# EAGLE design HighPowerWS2801_v1_smd (EAGLE 8.0.0)
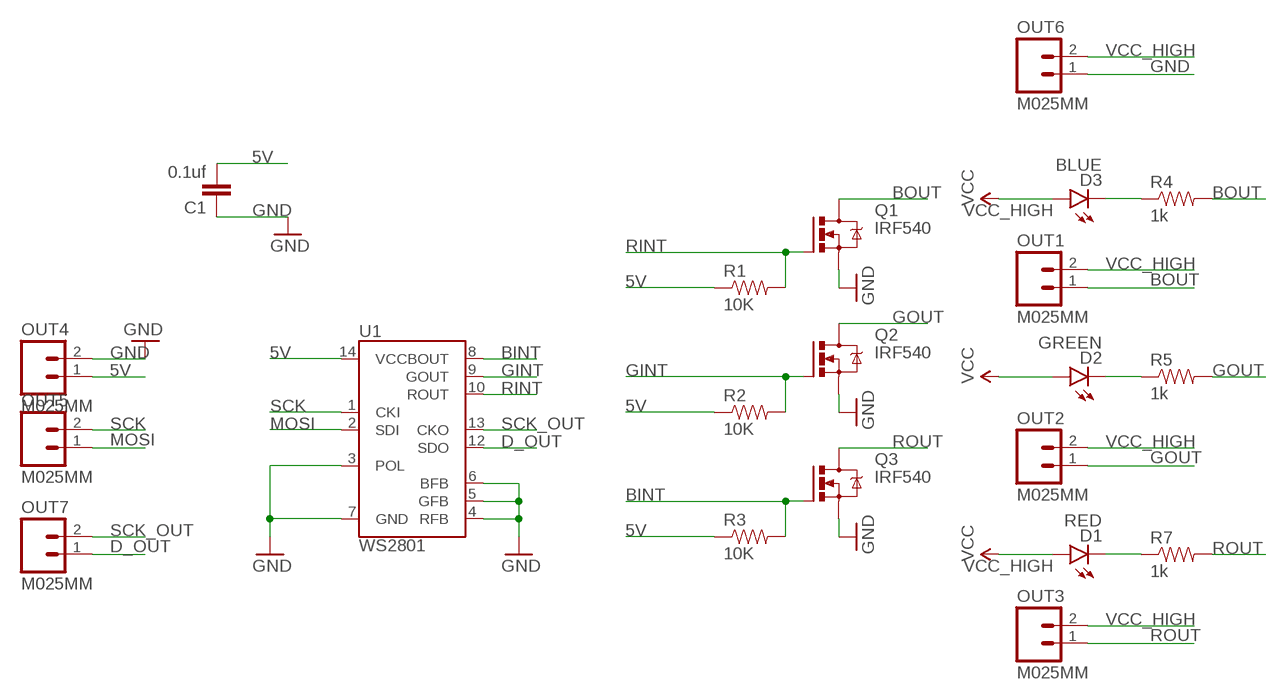
[diagram p0: schematic, sheet 1]

## Parts
C1  0.1uf  CAP0603-CAP  [0603-CAP]
D1  RED  LED-RED0603  [LED-0603]
D2  GREEN  LED-GREEN0603  [LED-0603]
D3  BLUE  LED-BLUE0603  [LED-0603]
OUT1  M025MM  [SCREWTERMINAL-5MM-2]
OUT2  M025MM  [SCREWTERMINAL-5MM-2]
OUT3  M025MM  [SCREWTERMINAL-5MM-2]
OUT4  M025MM  [SCREWTERMINAL-5MM-2]
OUT5  M025MM  [SCREWTERMINAL-5MM-2]
OUT6  M025MM  [SCREWTERMINAL-5MM-2]
OUT7  M025MM  [SCREWTERMINAL-5MM-2]
Q1  IRF540  [TO220BV]
Q2  IRF540  [TO220BV]
Q3  IRF540  [TO220BV]
R1  10K  RESISTOR0603  [0603-RES]
R2  10K  RESISTOR0603  [0603-RES]
R3  10K  RESISTOR0603  [0603-RES]
R4  1k  RESISTOR0603  [0603-RES]
R5  1k  RESISTOR0603  [0603-RES]
R7  1k  RESISTOR0603  [0603-RES]
U1  WS2801  [SOP-14]

## Nets
5V: C1.2 OUT4.1 R1.1 R2.1 R3.1 U1.14(VCC)
BINT: Q3.G R3.2 U1.8(BOUT)
BOUT: OUT1.1 Q1.D R4.2
D_OUT: OUT7.1 U1.12(SDO)
GINT: Q2.G R2.2 U1.9(GOUT)
GND: C1.1 OUT4.2 OUT6.1 Q1.S Q2.S Q3.S U1.3(POL) U1.4(RFB) U1.5(GFB) U1.6(BFB) U1.7(GND)
GOUT: OUT2.1 Q2.D R5.2
MOSI: OUT5.1 U1.2(SDI)
N$1: D3.C R4.1
N$2: D2.C R5.1
N$6: D1.C R7.1
RINT: Q1.G R1.2 U1.10(ROUT)
ROUT: OUT3.1 Q3.D R7.2
SCK: OUT5.2 U1.1(CKI)
SCK_OUT: OUT7.2 U1.13(CKO)
VCC_HIGH: D1.A D2.A D3.A OUT1.2 OUT2.2 OUT3.2 OUT6.2 ; supply symbol labelled VCC

## Library data of the parts
C1 = SparkFun-Capacitors:CAP: Capacitor Standard 0603 ceramic capacitor, and 0.1" leaded capacitor.
D1 = SparkFun-LED:LED-RED: Assorted Red LEDs LilyPad 1206- DIO-09912 1206- DIO-00809 0603- DIO-00819 "SMART" means more efficient and expensive; PROD_ID: DIO-00819
D2 = SparkFun-LED:LED-GREEN: Various green LEDs Green LEDs used in SFE Production 0603- DIO-00821 LARGE- DIO-00862 LILYPAD- DIO-09910; PROD_ID: DIO-00821
D3 = SparkFun-LED:LED-BLUE: Blue LEDs for production use Various blue LEDs stocked by SparkFun production 0603 - DIO-08575 Rebel - DIO-09553 1206 - DIO-09911; PROD_ID: DIO-08575
OUT1-OUT7 = SparkFun-Connectors:M02: Standard 2-pin 0.1" header. Use with - straight break away headers ( PRT-00116) - right angle break away headers (PRT-00553) - swiss pins (PRT-00743) - machine pins (PRT-00117) - female headers (PRT-00115) Molex polarized connector foot print use with: PRT-08233 with associated crimp pins and housings. 2.54_SCREWTERM for use with PRT-10571. 3.5mm Screw Terminal footprints for PRT-08084 5mm Screw Terminal footprints for use with PRT-08433
Q1-Q3 = transistor-power:IRF540: HEXFET Power MOSFET
R1-R5 R7 = SparkFun-Resistors:RESISTOR: Resistor Basic schematic elements and footprints for 0603, 1206, and PTH resistors.
U1 = SparkFun-DigitalIC:WS2801: WS2801 3 Channel Constant Current LED Driver with programmable PWM outputs. Datasheet: http://www.sparkfun.com/datasheets/Components/LED/WS2801.pdf

## Board
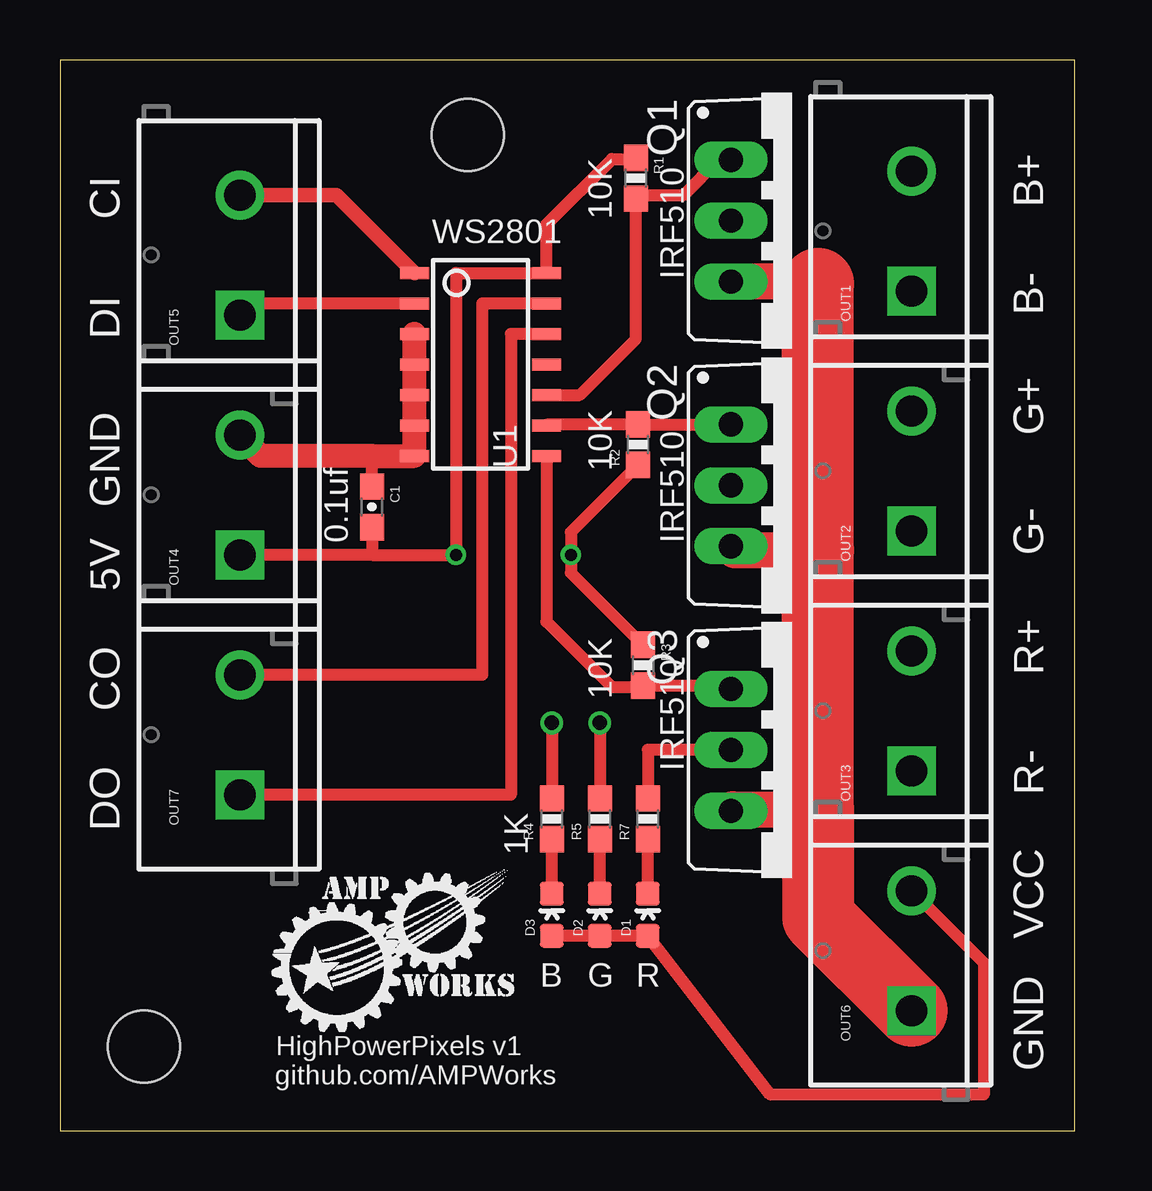
[diagram p1: board, top side]
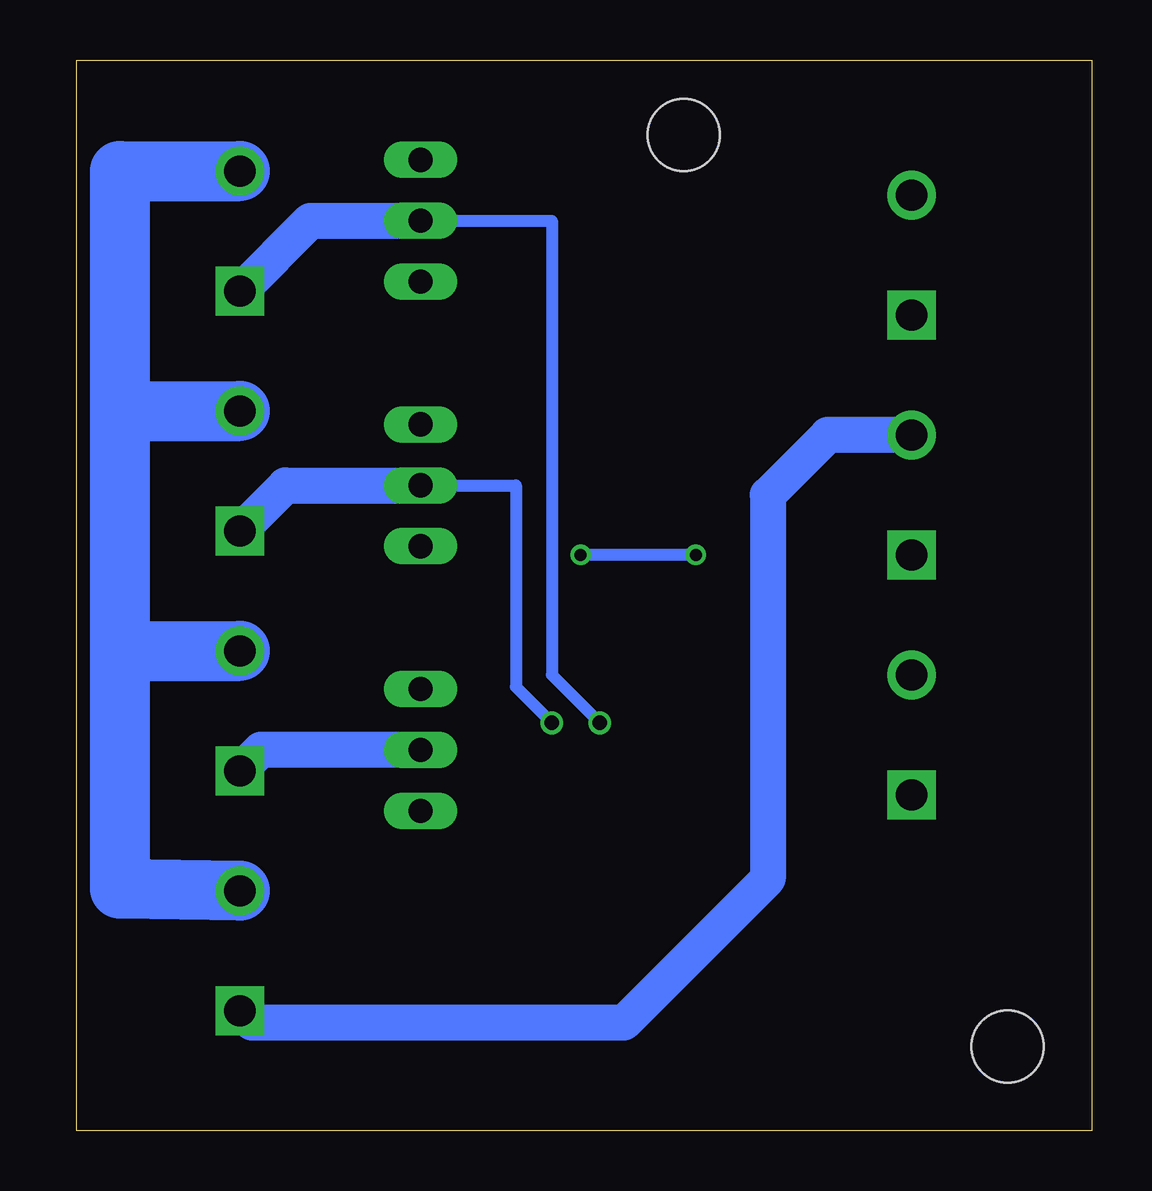
[diagram p2: board, bottom side, seen from below]

Size 42.3 x 44.63 mm. Coordinates in mm from the lower left corner, seen from the top.
Outline: 0,0 42.3,0 42.3,44.63 0,44.63 0,0
Copper layers (1*16): Top 0.0356mm / dielectric 1.5011mm / Bottom 0.0356mm
Design rules "OSHParkDesignRules": minimum track width 6mil, minimum drill 13mil, track to track 6mil, track to pad 6mil, pad to pad 6mil, via to via 6mil, smd to smd 6mil, copper to edge 15mil, drill to drill 6mil, minimum pad ring 7mil, minimum via ring 7mil, stop-mask expansion 3mil, vias tented up to drill 0mil, thermal gap 10mil
Holes 3 mm at 3.5,3.5 17,41.5

### Footprints (pad centres in the part's own frame; a part is rotated, then mirrored left to right if it is on the bottom)
0603-CAP = smd 1.1 x 1: 1 -0.85,0; 2 0.85,0
LED-0603 = smd 1 x 1: A 0,-0.877; C 0,0.877
SCREWTERMINAL-5MM-2 = drill 1.3 pad 2.032 square: 1 0,0 | drill 1.3 pad 2.032: 2 5,0
TO220BV = drill 1.016 long: D 0,-2.54; G -2.54,-2.54; S 2.54,-2.54
0603-RES = smd 1.1 x 1: 1 -0.85,0; 2 0.85,0
SOP-14 = smd 0.5 x 1.2: 1 -3.81,-2.75; 2 -2.54,-2.75; 3 -1.27,-2.75; 4 0,-2.75; 5 1.27,-2.75; 6 2.54,-2.75; 7 3.81,-2.75; 8 3.81,2.75; 9 2.54,2.75; 10 1.27,2.75; 11 0,2.75; 12 -1.27,2.75; 13 -2.54,2.75; 14 -3.81,2.75

### Placement (x,y rotation side)
C1  13,26 270 top
D1  24.5,9 0 top
D2  22.5,9 0 top
D3  20.5,9 0 top
OUT1  35.5,35 90 top
OUT2  35.5,25 90 top
OUT3  35.5,15 90 top
OUT4  7.5,24 90 top
OUT5  7.5,34 90 top
OUT6  35.5,5 90 top
OUT7  7.5,14 90 top
Q1  30.51,37.93 270 top
Q2  30.51,26.9 270 top
Q3  30.51,15.87 270 top
R1  24,39.7 270 top
R2  24.1,28.6 90 top
R3  24.3,19.4 270 top
R4  20.5,13 90 top
R5  22.5,13 90 top
R7  24.5,13 90 top
U1  17.53,31.94 270 top

### Tracks (layer width: path | path; a pad name or v marks a point on that pad's centre or on a via)
5V  (via drill 0.5)
  Top 0.5: 13,24 v16.5,24 16.5,35.75 U1.14 20.28,37.78 23,40.5 23.95,40.5 R1.1 | 13,24 OUT4.1 | C1.2 13,24 | R2.1 21.3,24.95 v21.3,24 21.3,23.25 R3.1
  Bottom 0.5: v16.5,24 v21.3,24
BINT
  Top 0.5: Q3.G 27.83,18.55 R3.2 24.25,18.5 23,18.5 20.28,21.22 U1.8
BOUT  (via drill 0.6)
  Top 0.5: v20.5,17 R4.2
  Bottom 0.5: Q1.D 22.5,37.93 22.5,19 v20.5,17
  Bottom 1.5: Q1.D 32.57,37.93 OUT1.1
D_OUT
  Top 0.5: U1.12 18.8,33.21 18.8,14 OUT7.1
GINT
  Top 0.5: U1.9 20.33,29.45 R2.2 Q2.G
GND
  Top 0.5: C1.1 13,28.13
  Top 1: OUT4.2 8.37,28.13 13,28.13 U1.7 U1.6 U1.5 U1.4 U1.3
  Top 1.5: 31.6,35.3 31.51,35.39 Q1.S | Q2.S 28.13,24.2 31.6,24.2 | Q3.S 28.04,13.4 31.6,13.4
  Top 3: OUT6.1 31.6,8.9 31.6,13.4 31.6,24.2 31.6,35.3
  Bottom 1.5: OUT4.2 11,29 13.5,26.5 13.5,10.5 19.5,4.5 35,4.5 OUT6.1
GOUT  (via drill 0.6)
  Top 0.5: v22.5,17 R5.2
  Bottom 0.5: Q2.D 24,26.9 24,18.5 v22.5,17
  Bottom 1.5: Q2.D 33.6,26.9 OUT2.1
MOSI
  Top 0.5: U1.2 7.98,34.48 OUT5.1
N$1
  Top 0.5: D3.C R4.1
N$2
  Top 0.5: D2.C R5.1
N$6
  Top 0.5: D1.C R7.1
RINT
  Top 0.5: U1.10 21.67,30.67 24,33 R1.2 24.15,39 26,39 27.47,40.47 Q1.G
ROUT
  Top 0.5: Q3.D 24.5,15.87 R7.2
  Bottom 1.5: Q3.D 34.63,15.87 OUT3.1
SCK
  Top 0.6: U1.1 11.53,39 OUT5.2
SCK_OUT
  Top 0.5: U1.13 17.6,34.48 17.6,19 OUT7.2
VCC_HIGH
  Top 0.5: OUT6.2 38.5,7 38.5,1.5 29.62,1.5 D1.A D2.A D3.A
  Bottom 1.5: OUT3.2 35.43,20.07 | OUT1.2 35.46,39.96
  Bottom 2.5: OUT6.2 40.5,10.08 40.5,20 | 40.5,20 OUT3.2 | 40.5,20 40.5,30 | 40.5,30 OUT2.2 | 40.5,30 40.5,40 OUT1.2

### Text on the board
tPlace: HighPowerPixels v1 | github.com/AMPWorks
tNames: CI | 10K | B+ | WS2801 | IRF510 | B- | DI | G+ | 10K | GND | 0.1uf | IRF510 | G- | 5V | R+ | CO | 10K | IRF510 | R- | DO | 1K | VCC | B | G | R | GND